# Altium schematic sheet ST1-1-Top.SchDoc: Top
size A3; DocumentNumber: 1; SheetNumber: 1; SheetTotal: 20
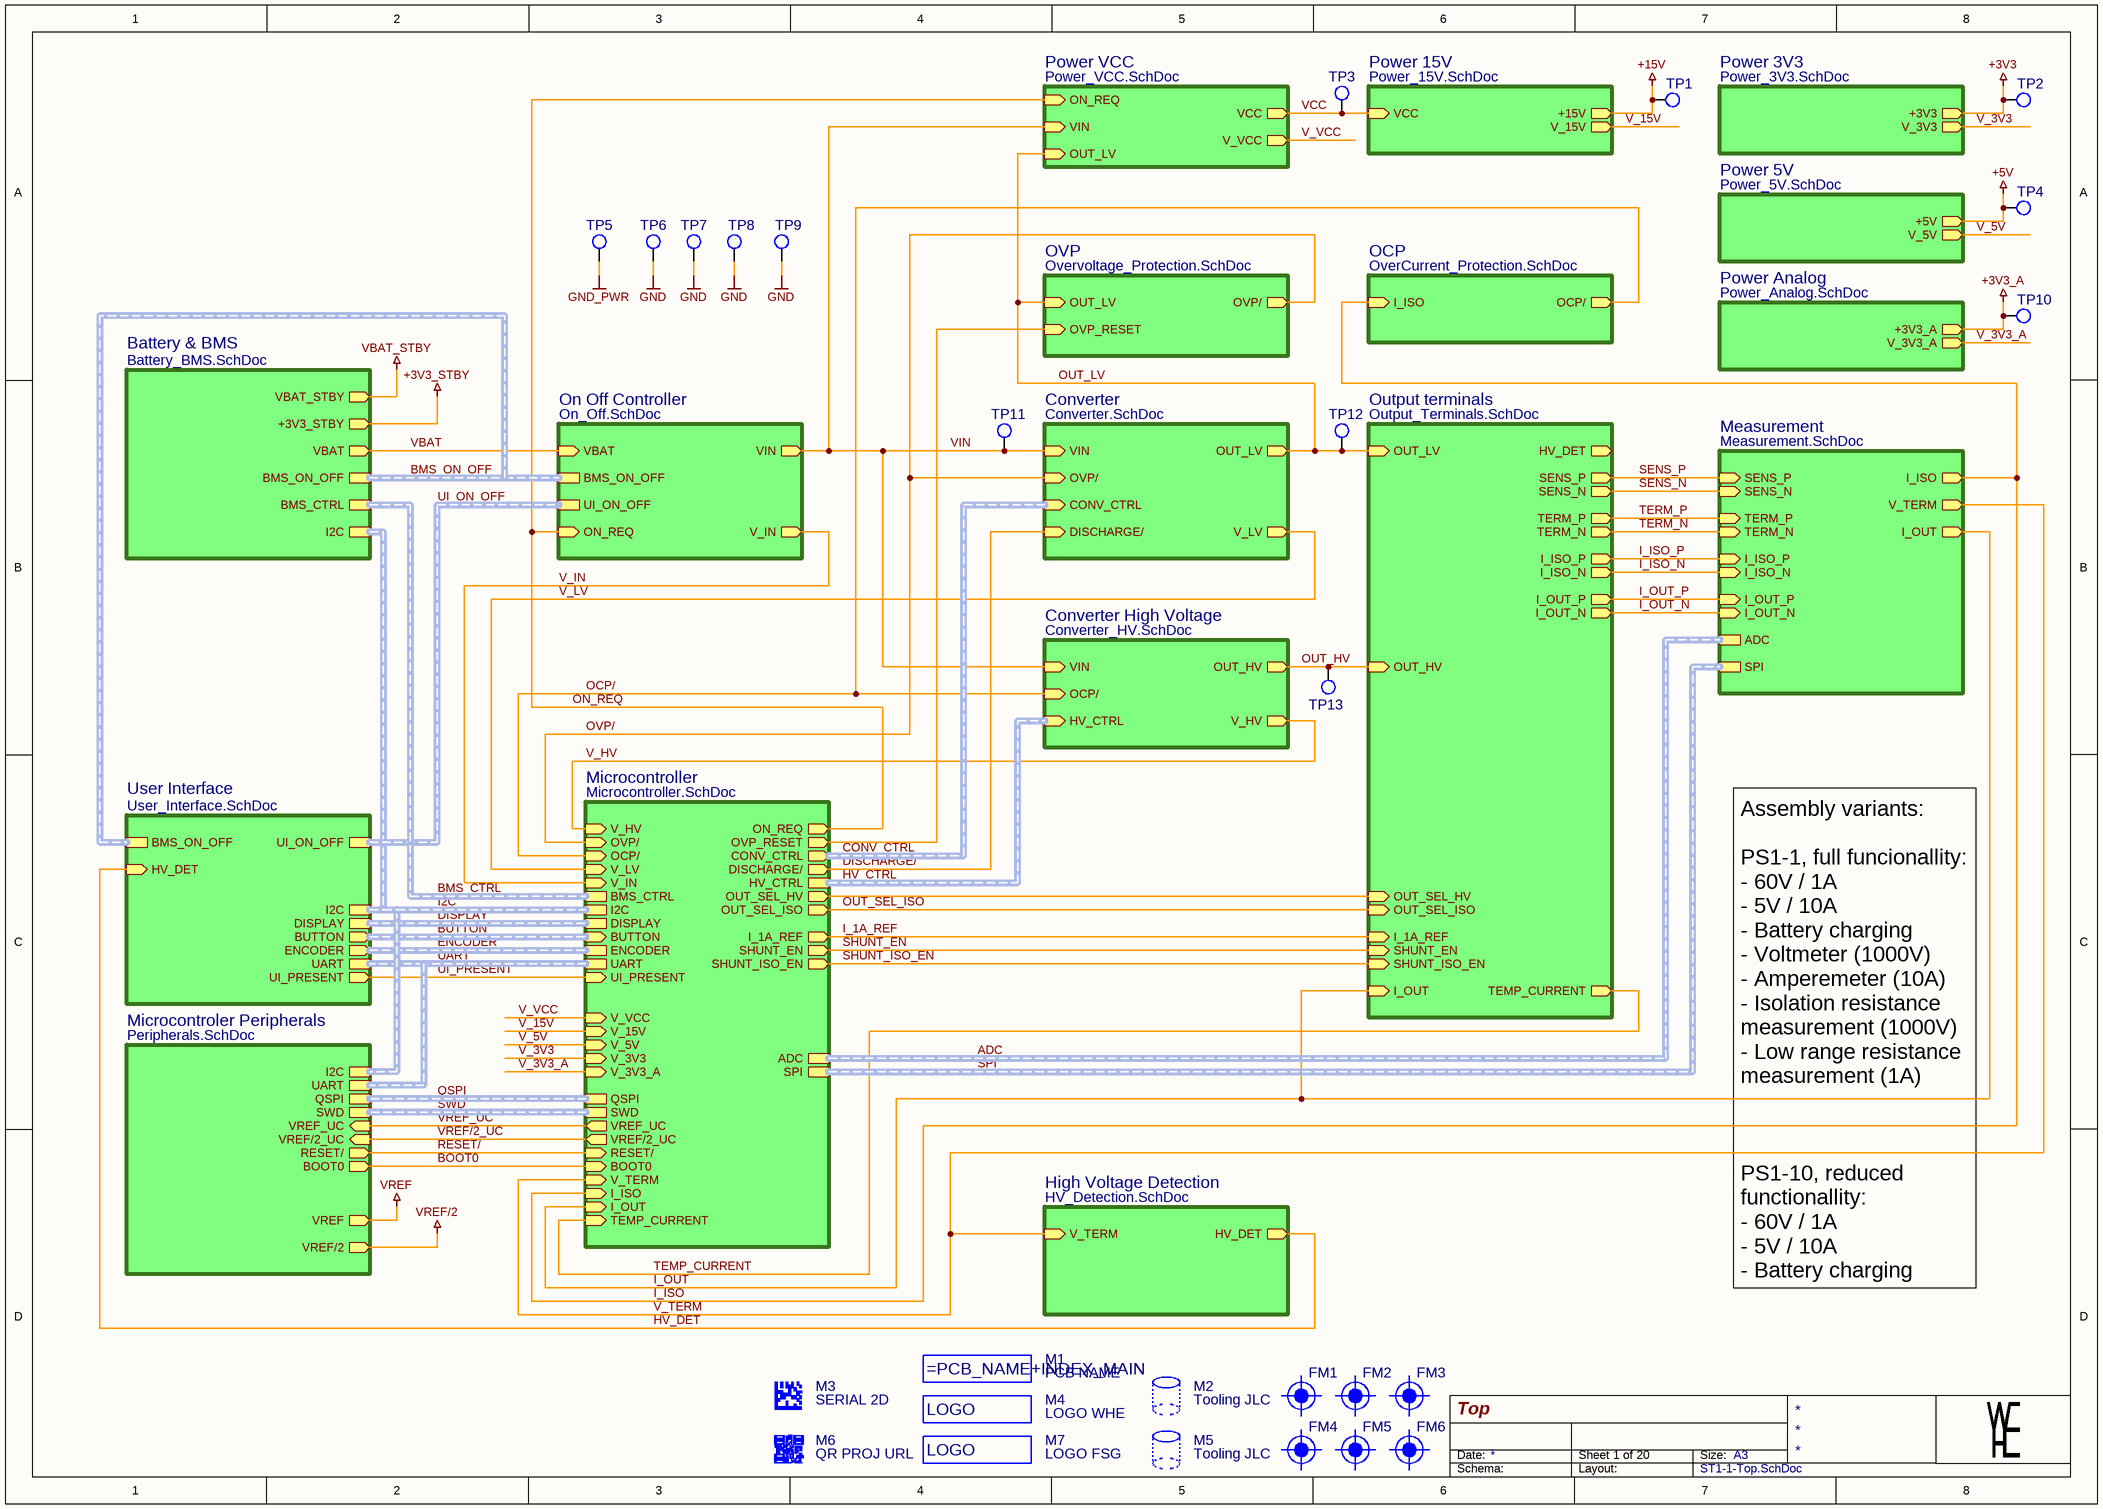
[diagram p0: ST1-1-Top.SchDoc]

## Parts
FM1  Fidu  [FIDU-1MM]  (value not drawn)  (no BOM)
FM2  Fidu  [FIDU-1MM]  (value not drawn)  (no BOM)
FM3  Fidu  [FIDU-1MM]  (value not drawn)  (no BOM)
FM4  Fidu  [FIDU-1MM]  (value not drawn)  (no BOM)
FM5  Fidu  [FIDU-1MM]  (value not drawn)  (no BOM)
FM6  Fidu  [FIDU-1MM]  (value not drawn)  (no BOM)
M1  PCB NAME  [PCB-NAME-5MM-LEFT]
M2  Tooling JLC  [TOOLING-JLC]
M3  SERIAL 2D  [SERIAL-2D-10MM-RESTRICT]
M4  LOGO WHE  [LOGO-WHE-10MM]
M5  Tooling JLC  [TOOLING-JLC]
M6  QR PROJ URL  [QR-PROJECT-URL-10MM]
M7  LOGO FSG  [LOGO-FSG-10MM]
TP1  TP_THD_1.5/0.8  [TP_THD_1.5/0.8]  (value not drawn)  (no BOM)
TP2  TP_THD_1.5/0.8  [TP_THD_1.5/0.8]  (value not drawn)  (no BOM)
TP3  TP_THD_1.5/0.8  [TP_THD_1.5/0.8]  (value not drawn)  (no BOM)
TP4  TP_THD_1.5/0.8  [TP_THD_1.5/0.8]  (value not drawn)  (no BOM)
TP5  TP_THD_1.5/0.8  [TP_THD_1.5/0.8]  (value not drawn)  (no BOM)
TP6  TP_THD_1.5/0.8  [TP_THD_1.5/0.8]  (value not drawn)  (no BOM)
TP7  TP_THD_1.5/0.8  [TP_THD_1.5/0.8]  (value not drawn)  (no BOM)
TP8  TP_THD_1.5/0.8  [TP_THD_1.5/0.8]  (value not drawn)  (no BOM)
TP9  TP_THD_1.5/0.8  [TP_THD_1.5/0.8]  (value not drawn)  (no BOM)
TP10  TP_THD_1.5/0.8  [TP_THD_1.5/0.8]  (value not drawn)  (no BOM)
TP11  TP_THD_1.5/0.8  [TP_THD_1.5/0.8]  (value not drawn)  (no BOM)
TP12  TP_THD_1.5/0.8  [TP_THD_1.5/0.8]  (value not drawn)  (no BOM)
TP13  TP_THD_1.5/0.8  [TP_THD_1.5/0.8]  (value not drawn)  (no BOM)

## Sub-sheets
Battery & BMS = Battery_BMS.SchDoc: VBAT (out), I2C (harness I2C), BMS_ON_OFF (harness BMS_ON_OFF), VBAT_STBY (out), BMS_CTRL (harness BMS_CTRL), +3V3_STBY (out)
Converter = Converter.SchDoc: VIN (in), CONV_CTRL (in, harness CONV_CTRL), OUT_LV (out), OVP/ (in), DISCHARGE/ (in), V_LV (out)
Converter High Voltage = Converter_HV.SchDoc: VIN (in), OUT_HV (out), OCP/ (in), HV_CTRL (in, harness HV_CTRL), V_HV (out)
High Voltage Detection = HV_Detection.SchDoc: V_TERM (in), HV_DET (out)
Measurement = Measurement.SchDoc: SENS_N (in), SENS_P (in), ADC (harness ADC), SPI (harness SPI), TERM_P (in), TERM_N (in), V_TERM (out), I_OUT (out), I_OUT_P (in), I_OUT_N (in), I_ISO_P (in), I_ISO_N (in), I_ISO (out)
Microcontroler Peripherals = Peripherals.SchDoc: I2C (harness I2C), UART (harness UART), QSPI (harness QSPI), VREF (out), SWD (harness SWD), VREF_UC (in), RESET/ (out), BOOT0 (out), VREF/2 (out), VREF/2_UC (in)
Microcontroller = Microcontroller.SchDoc: CONV_CTRL (out, harness CONV_CTRL), ON_REQ (out), I_1A_REF (out), SHUNT_EN (out), SPI (harness SPI), OUT_SEL_ISO (out), SHUNT_ISO_EN (out), V_HV (in), DISCHARGE/ (out), OVP/ (in), OUT_SEL_HV (out), HV_CTRL (harness HV_CTRL), OVP_RESET (out), OCP/ (in), BOOT0 (in), RESET/ (in), VREF/2_UC (out), VREF_UC (out), SWD (harness SWD), QSPI (harness QSPI), V_3V3_A (in), V_3V3 (in), V_5V (in), V_15V (in), V_VCC (in), UI_PRESENT (in), BMS_CTRL (harness BMS_CTRL), V_IN (in), V_LV (in), UART (harness UART), ENCODER (harness Encoder), BUTTON (in, harness BUTTON), DISPLAY (harness DISPLAY), I2C (harness I2C), ADC (harness ADC), TEMP_CURRENT (in), I_OUT (in), V_TERM (in), I_ISO (in)
OCP = OverCurrent_Protection.SchDoc: I_ISO (in), OCP/ (out)
On Off Controller = On_Off.SchDoc: VIN (out), VBAT (in), ON_REQ (in), V_IN (out), UI_ON_OFF (harness ON_OFF), BMS_ON_OFF (harness BMS_ON_OFF)
Output terminals = Output_Terminals.SchDoc: SENS_P (out), SENS_N (out), TERM_P (out), TERM_N (out), I_OUT_P (out), I_OUT_N (out), I_ISO_P (out), I_ISO_N (out), HV_DET (out), OUT_LV (in), OUT_SEL_HV (in), OUT_SEL_ISO (in), TEMP_CURRENT (out), I_OUT (in), I_1A_REF (in), SHUNT_EN (in), SHUNT_ISO_EN (in), OUT_HV (in)
OVP = Overvoltage_Protection.SchDoc: OUT_LV (in), OVP/ (out), OVP_RESET (in)
Power 3V3 = Power_3V3.SchDoc: +3V3 (out), V_3V3 (out)
Power 5V = Power_5V.SchDoc: +5V (out), V_5V (out)
Power 15V = Power_15V.SchDoc: +15V (out), VCC (in), V_15V (out)
Power Analog = Power_Analog.SchDoc: +3V3_A (out), V_3V3_A (out)
Power VCC = Power_VCC.SchDoc: VIN (in), OUT_LV (in), VCC (out), ON_REQ (in), V_VCC (out)
User Interface = User_Interface.SchDoc: ENCODER (out, harness Encoder), BUTTON (out, harness BUTTON), UI_ON_OFF (harness ON_OFF), I2C (harness I2C), HV_DET (in), UART (harness UART), UI_PRESENT (out), DISPLAY (harness DISPLAY), BMS_ON_OFF (harness BMS_ON_OFF)

## Nets
+3V3: TP2.1 ; sheet Power 3V3/+3V3
+3V3_A: TP10.1 ; sheet Power Analog/+3V3_A
+3V3_STBY: sheet Battery & BMS/+3V3_STBY
+5V: TP4.1 ; sheet Power 5V/+5V
+15V: TP1.1 ; sheet Power 15V/+15V
GND: TP6.1 TP7.1 TP8.1 TP9.1
GND_PWR: TP5.1
VBAT_STBY: sheet Battery & BMS/VBAT_STBY
VREF: sheet Microcontroler Peripherals/VREF
VREF/2: sheet Microcontroler Peripherals/VREF/2
BOOT0: sheet Microcontroller/BOOT0, sheet Microcontroler Peripherals/BOOT0
DISCHARGE/: sheet Microcontroller/DISCHARGE/, sheet Converter/DISCHARGE/
HV_DET: sheet User Interface/HV_DET, sheet High Voltage Detection/HV_DET
I_1A_REF: sheet Microcontroller/I_1A_REF, sheet Output terminals/I_1A_REF
I_ISO: sheet Microcontroller/I_ISO, sheet Measurement/I_ISO, sheet OCP/I_ISO
I_ISO_N: sheet Output terminals/I_ISO_N, sheet Measurement/I_ISO_N
I_ISO_P: sheet Output terminals/I_ISO_P, sheet Measurement/I_ISO_P
I_OUT: sheet Microcontroller/I_OUT, sheet Output terminals/I_OUT, sheet Measurement/I_OUT
I_OUT_N: sheet Output terminals/I_OUT_N, sheet Measurement/I_OUT_N
I_OUT_P: sheet Output terminals/I_OUT_P, sheet Measurement/I_OUT_P
OCP/: sheet Microcontroller/OCP/, sheet Converter High Voltage/OCP/, sheet OCP/OCP/
ON_REQ: sheet Microcontroller/ON_REQ, sheet On Off Controller/ON_REQ, sheet Power VCC/ON_REQ
OUT_HV: TP13.1 ; sheet Output terminals/OUT_HV, sheet Converter High Voltage/OUT_HV
OUT_LV: TP12.1 ; sheet Converter/OUT_LV, sheet Output terminals/OUT_LV, sheet Power VCC/OUT_LV, sheet OVP/OUT_LV
OUT_SEL_ISO: sheet Microcontroller/OUT_SEL_ISO, sheet Output terminals/OUT_SEL_ISO
OVP/: sheet Microcontroller/OVP/, sheet Converter/OVP/, sheet OVP/OVP/
RESET/: sheet Microcontroller/RESET/, sheet Microcontroler Peripherals/RESET/
SENS_N: sheet Output terminals/SENS_N, sheet Measurement/SENS_N
SENS_P: sheet Output terminals/SENS_P, sheet Measurement/SENS_P
SHUNT_EN: sheet Microcontroller/SHUNT_EN, sheet Output terminals/SHUNT_EN
SHUNT_ISO_EN: sheet Microcontroller/SHUNT_ISO_EN, sheet Output terminals/SHUNT_ISO_EN
TEMP_CURRENT: sheet Microcontroller/TEMP_CURRENT, sheet Output terminals/TEMP_CURRENT
TERM_N: sheet Output terminals/TERM_N, sheet Measurement/TERM_N
TERM_P: sheet Output terminals/TERM_P, sheet Measurement/TERM_P
UI_PRESENT: sheet Microcontroller/UI_PRESENT, sheet User Interface/UI_PRESENT
V_3V3: sheet Microcontroller/V_3V3, sheet Power 3V3/V_3V3
V_3V3_A: sheet Microcontroller/V_3V3_A, sheet Power Analog/V_3V3_A
V_5V: sheet Microcontroller/V_5V, sheet Power 5V/V_5V
V_15V: sheet Microcontroller/V_15V, sheet Power 15V/V_15V
V_HV: sheet Microcontroller/V_HV, sheet Converter High Voltage/V_HV
V_IN: sheet Microcontroller/V_IN, sheet On Off Controller/V_IN
V_LV: sheet Microcontroller/V_LV, sheet Converter/V_LV
V_TERM: sheet Microcontroller/V_TERM, sheet Measurement/V_TERM, sheet High Voltage Detection/V_TERM
V_VCC: sheet Microcontroller/V_VCC, sheet Power VCC/V_VCC
VBAT: sheet Battery & BMS/VBAT, sheet On Off Controller/VBAT
VCC: TP3.1 ; sheet Power VCC/VCC, sheet Power 15V/VCC
VIN: TP11.1 ; sheet Converter/VIN, sheet On Off Controller/VIN, sheet Power VCC/VIN, sheet Converter High Voltage/VIN
VREF/2_UC: sheet Microcontroller/VREF/2_UC, sheet Microcontroler Peripherals/VREF/2_UC
VREF_UC: sheet Microcontroller/VREF_UC, sheet Microcontroler Peripherals/VREF_UC
(unnamed): sheet Microcontroller/OUT_SEL_HV, sheet Output terminals/OUT_SEL_HV
(unnamed): sheet Microcontroller/OVP_RESET, sheet OVP/OVP_RESET

## Buses and harness runs
harness ADC = sheet Measurement/ADC = sheet Microcontroller/ADC
harness BMS_CTRL = sheet Battery & BMS/BMS_CTRL = sheet Microcontroller/BMS_CTRL
harness BMS_ON_OFF = sheet Battery & BMS/BMS_ON_OFF = sheet On Off Controller/BMS_ON_OFF = sheet User Interface/BMS_ON_OFF
harness BUTTON = sheet Microcontroller/BUTTON = sheet User Interface/BUTTON
harness CONV_CTRL = sheet Converter/CONV_CTRL = sheet Microcontroller/CONV_CTRL
harness DISPLAY = sheet Microcontroller/DISPLAY = sheet User Interface/DISPLAY
harness ENCODER = sheet Microcontroller/ENCODER = sheet User Interface/ENCODER
harness HV_CTRL = sheet Converter High Voltage/HV_CTRL = sheet Microcontroller/HV_CTRL
harness I2C = sheet Battery & BMS/I2C = sheet Microcontroler Peripherals/I2C = sheet Microcontroller/I2C = sheet User Interface/I2C
harness QSPI = sheet Microcontroler Peripherals/QSPI = sheet Microcontroller/QSPI
harness SPI = sheet Measurement/SPI = sheet Microcontroller/SPI
harness SWD = sheet Microcontroler Peripherals/SWD = sheet Microcontroller/SWD
harness UART = sheet Microcontroler Peripherals/UART = sheet Microcontroller/UART = sheet User Interface/UART
harness UI_ON_OFF = sheet On Off Controller/UI_ON_OFF = sheet User Interface/UI_ON_OFF

## Notes on the sheet
- Assembly variants:
  PS1-1, full funcionallity:
  - 60V / 1A
  - 5V / 10A
  - Battery charging
  - Voltmeter (1000V)
  - Amperemeter (10A)
  - Isolation resistance measurement (1000V)
  - Low range resistance measurement (1A)
  PS1-10, reduced functionallity:
  - 60V / 1A
  - 5V / 10A
  - Battery charging
- Date:
- Size:
- A3
- Schema:
- Layout:

## Library data of the parts
FM1-FM6 = Fidu_1mm: Fiducial 1mm; Manufacturer: NONE; Part Number: Fidu_1mm
M1 = PCB NAME 5mm L: PCB name, 5mm text height, left-aligned; Manufacturer: NONE; Part Number: PCB NAME 5mm L
M2 M5 = Tooling JLC: Tooling hole for JLC (1.152mm); Manufacturer: NONE; Part Number: Tooling JLC
M3 = SERIAL 2D 10MM RESTRICT: 2D Serial number placeholder, Dotmatrix or QR, size: 10mm, restriction on top layer; Manufacturer: NONE; Part Number: SERIAL 2D 10MM RESTRICT
M4 = LOGO WHE 10MM: WHE logo, size 10mm; Manufacturer: NONE; Part Number: LOGO WHE 10MM
M6 = QR PROJ URL 10MM: QR Code, Project URL, 10mm; Manufacturer: NONE; Part Number: QR PROJ URL 10MM
M7 = LOGO FSG 10MM: FSG logo, size 10mm; Manufacturer: NONE; Part Number: LOGO FSG 10MM
TP1-TP13 = TP_THD_1.5/0.8: THT Test Point 1.5/0.8mm; Manufacturer: NONE; Part Number: TP_THD_1.5/0.8